# EAGLE design switch-smd-20mm-mk-2.1 (EAGLE 7.5.0)
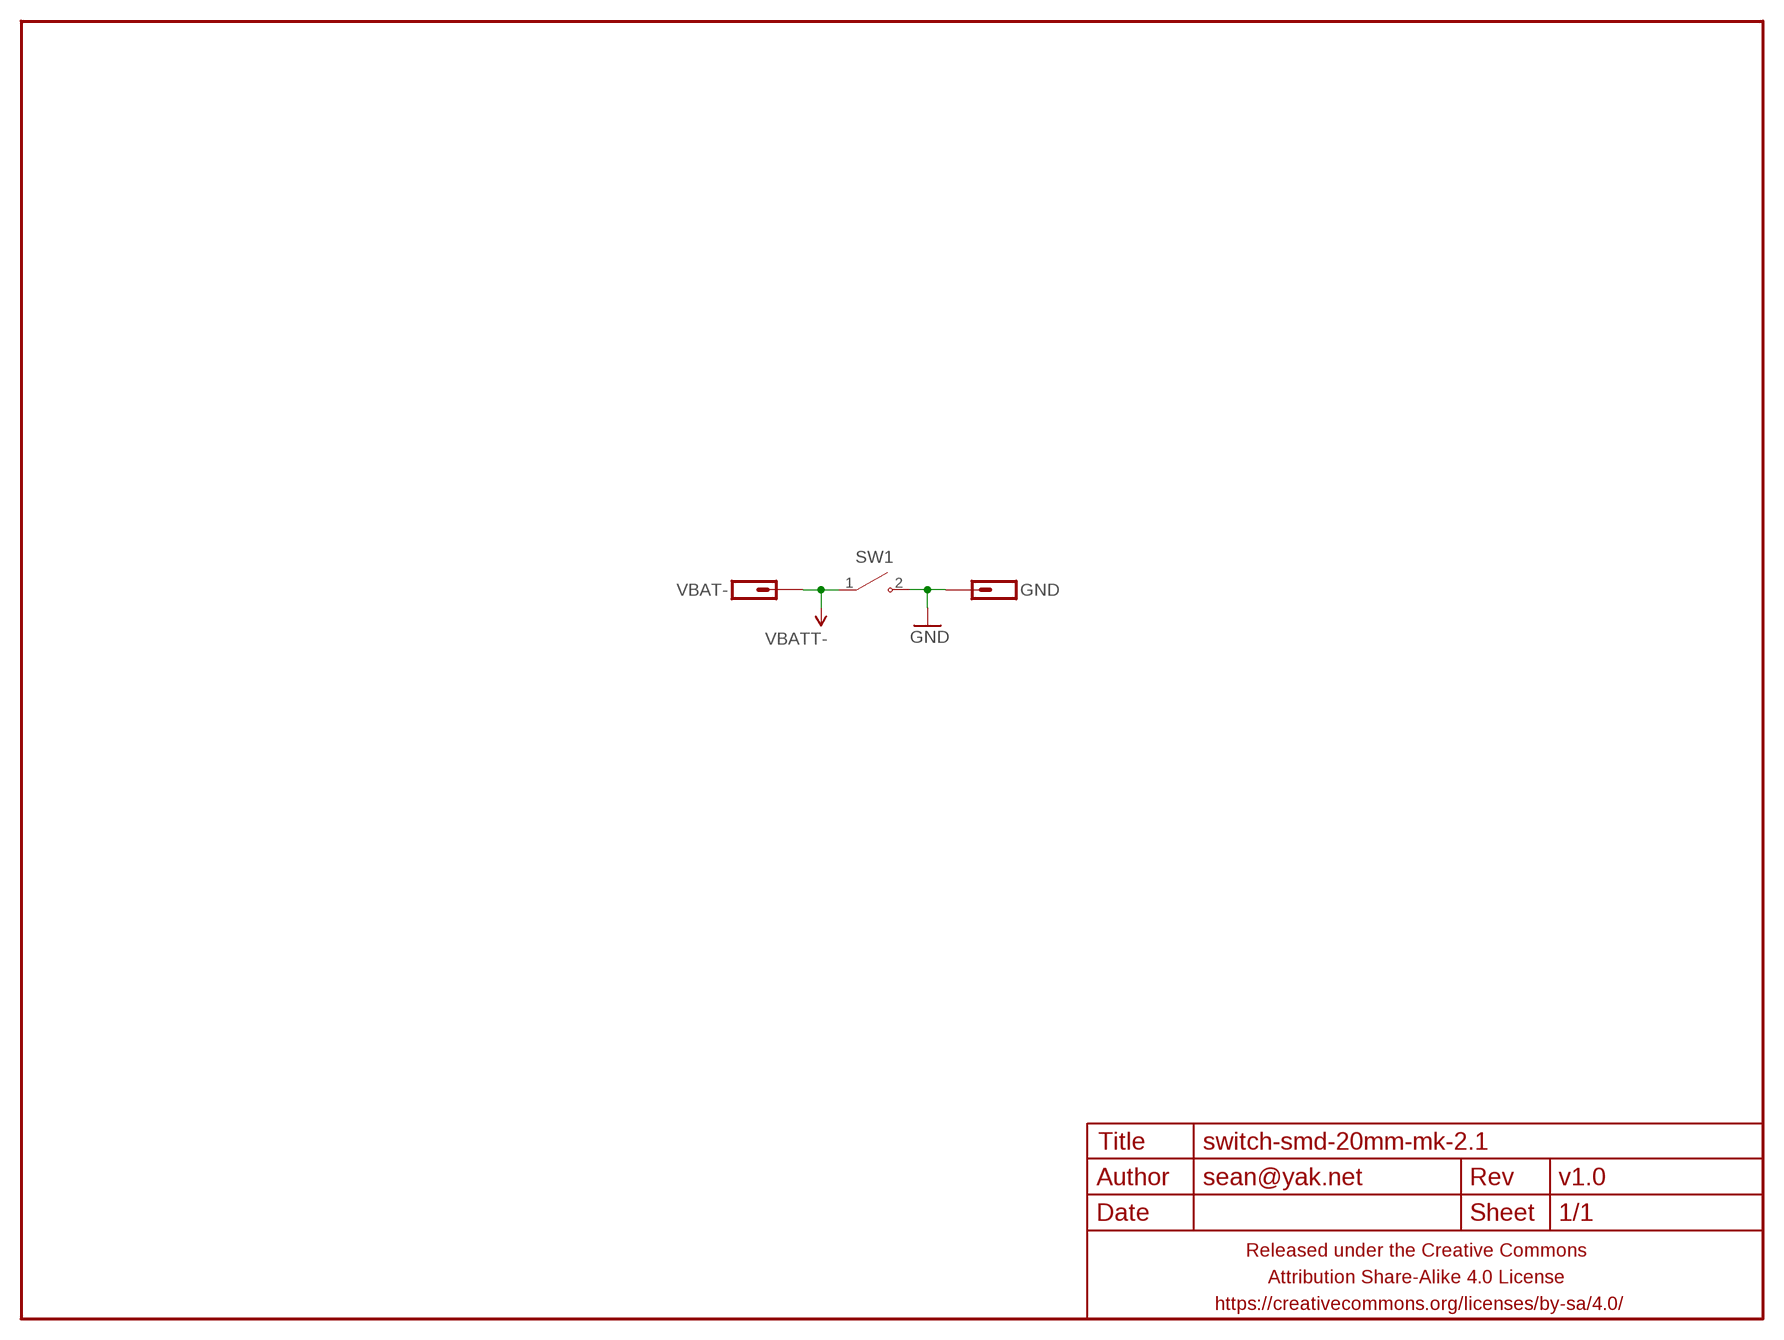
[diagram p0: schematic, sheet 1]

## Parts
FRAME1  FRAME-LETTERNO_PACKAGE  [DUMMY]
GND  M01SMD_ANCHOR  [1X01_SMD_ANCHOR]
SW1  SWITCH-SPSTKAN-9-PTH  [KAN-9]
VBAT-  M01PTH-1MM-CIR-NS  [1X01-1MM-CIR-NS]

## Nets
GND: GND.P$1 SW1.2(NO)
VBAT: SW1.1(COM) VBAT-.1 ; supply symbol labelled VBATT-

## Library data of the parts
FRAME1 = a_parts:FRAME-LETTER: Schematic Frame Standard 8.5x11 US Letter frame; DESIGNER: sean@yak.net; VERSION: v1.0
GND VBAT- = a_parts:M01: Header 1 Standard 1-pin 0.1" header. Use with straight break away headers (SKU : PRT-00116), right angle break away headers (PRT-00553), swiss pins (PRT-00743), machine pins (PRT-00117), and female headers (PRT-00115).
SW1 = a_parts:SWITCH-SPST

## Board
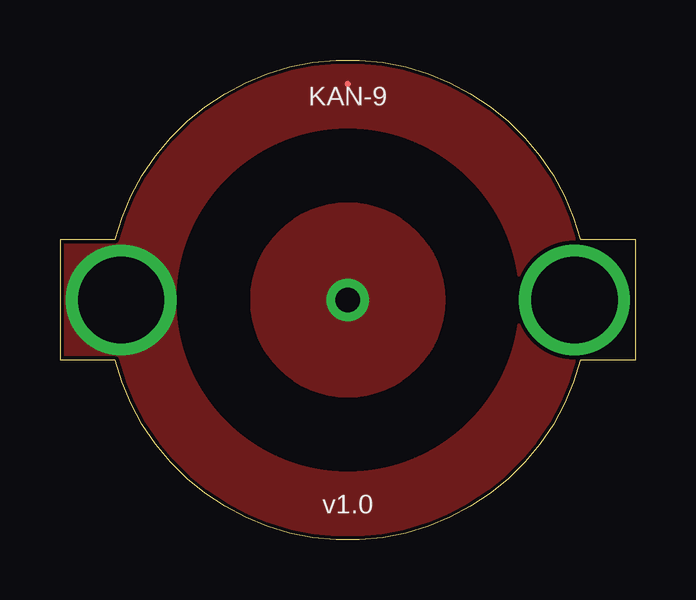
[diagram p1: board, top side]
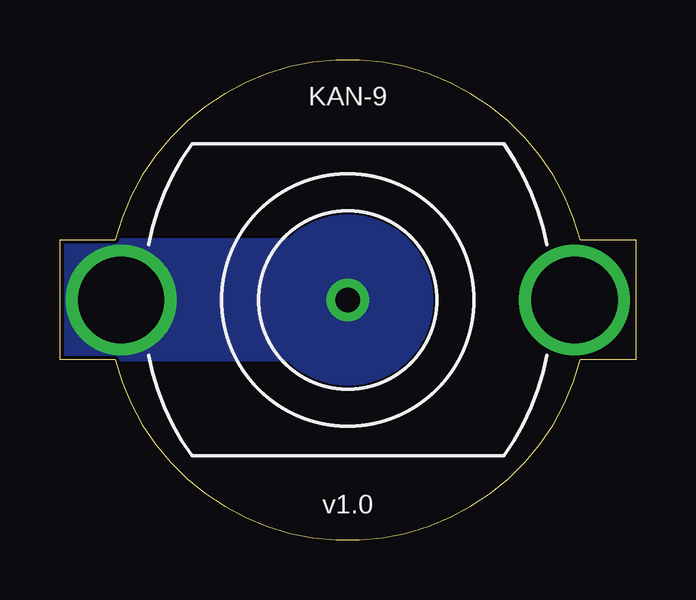
[diagram p2: board, bottom side, seen from below]

Size 24 x 20 mm. Coordinates in mm from the lower left corner, seen from the top.
Outline: 2.3,12.5 arc-151 21.7,12.5 24,12.5 24,7.5 21.7,7.5 arc-151 2.3,7.5 0,7.5 0,12.5 2.3,12.5
Copper layers (1*16): Top 0.0356mm / dielectric 1.5011mm / Bottom 0.0356mm
Design rules "LaenPCBOrder2 *": minimum track width 6mil, minimum drill 13mil, track to track 6mil, track to pad 6mil, pad to pad 6mil, via to via 6mil, smd to smd 6mil, copper to edge 3mil, drill to drill 6mil, minimum pad ring 7mil, minimum via ring 7mil, stop-mask expansion 3mil, vias tented up to drill 20mil, thermal gap 10mil
tRestrict: area 5.1,3.1 to 18.9,16.9

### Footprints (pad centres in the part's own frame; a part is rotated, then mirrored left to right if it is on the bottom)
1X01_SMD_ANCHOR = smd 0.254 x 0.254: P$1 0,0
KAN-9 = drill 3.6 pad 4.6: 1 -9.45,0; 2 9.45,0
1X01-1MM-CIR-NS = drill 1.016 pad 1.778: 1 0,0

### Placement (x,y rotation side)
FRAME1  0,-2 0 top
GND  12,19 90 top
SW1  12,10 0 bottom
VBAT-  12,10 0 top

### Tracks (layer width: path | path; a pad name or v marks a point on that pad's centre or on a via)
GND
  pour Top (isolate 0.152, rank 6, no thermals): 0,-2 0,22 24,22 24,-2
VBAT
  pour Top (isolate 0.152, no thermals): 8,10 arc-180 16,10 arc-180
  pour Bottom (isolate 0.152, rank 3, no thermals): 12,13.5 arc90 8.5,10 arc90 12,6.5 arc90 15.5,10 arc90
  pour Bottom (isolate 0.152, rank 3, no thermals): 10.5,12.5 24,12.5 24,7.5 10.5,7.5

### Text on the board
tPlace: KAN-9
bPlace: KAN-9